# Altium schematic sheet Power_Supply.SchDoc: Carte Découpe DMX
size A4
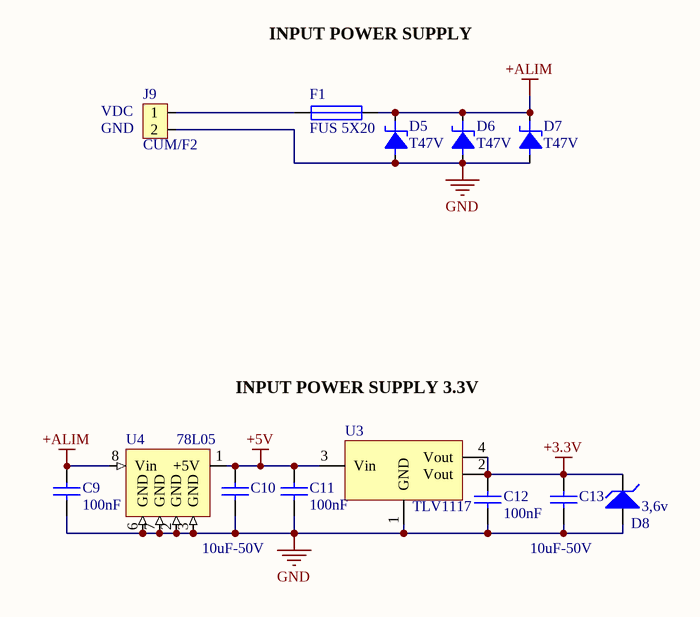
[diagram p0: Power_Supply.SchDoc]

## Parts
C9  100nF  [C0603]
C10  10uF-50V  [C1206]
C11  100nF  [C0603]
C12  100nF  [C0603]
C13  10uF-50V  [C1206]
D5  T47V  [DIO47A]
D6  T47V  [DIO47A]
D7  T47V  [DIO47A]
D8  3,6v  [SOD123]
F1  FUS 5X20  [FUSPO-A1]
J9  CUM/F2  [CNT2H]
U3  TLV1117  [SOT223]
U4  78L05  [REG5VE]

## Nets
+3.3V: C12.1 C13.2 D8.2(K) U3.2(Vout) U3.4(Vout)
+5V: C10.2 C11.1 U3.3(Vin) U4.1(+5V)
+ALIM: C9.1 D5.1 D6.1 D7.1 F1.2 U4.8(Vin)
GND: C9.2 C10.1 C11.2 C12.2 C13.1 D5.2 D6.2 D7.2 D8.1(A) J9.2 U3.1(GND) U4.2(GND) U4.3(GND) U4.6(GND) U4.7(GND)
NetF1_1: F1.1 J9.1

## Notes on the sheet
- INPUT POWER SUPPLY
- (near J9) VDC
- (near J9) GND
- INPUT POWER SUPPLY 3.3V
- Title
- Size:
- Date:
- A4
- Number:
- Time:
- Revision:
- Sheet
- of
- File:

## Library data of the parts
C9-C13 = Cap: Capacitor
  C9 C11 C12: Value: 100nF
  C10 C13: Value: 10uF-50V
D5-D7 = T47V: TRANSIL CMS 47V unidirectionnelle
D8 = D Zener: Zener Diode; Value: 3,6v
F1 = FUS 5X20: FUSIBLE VERRE 5 x 20
J9 = CUM/F2: connecteur  2 points
U3 = TLV1117: LDO regulator 3.3V; Fabricant: Texas; Fournisseur: Farnell; Ref_Fournisseur: 1703385; Prix: 0.75; Ref_Fabricant: TLV1117
U4 = 78L05: E:cms ;C1:faible conso; VD:TO220 debout;